# Altium schematic sheet Principal.SchDoc
size A3; SheetNumber: 2; SheetTotal: 22
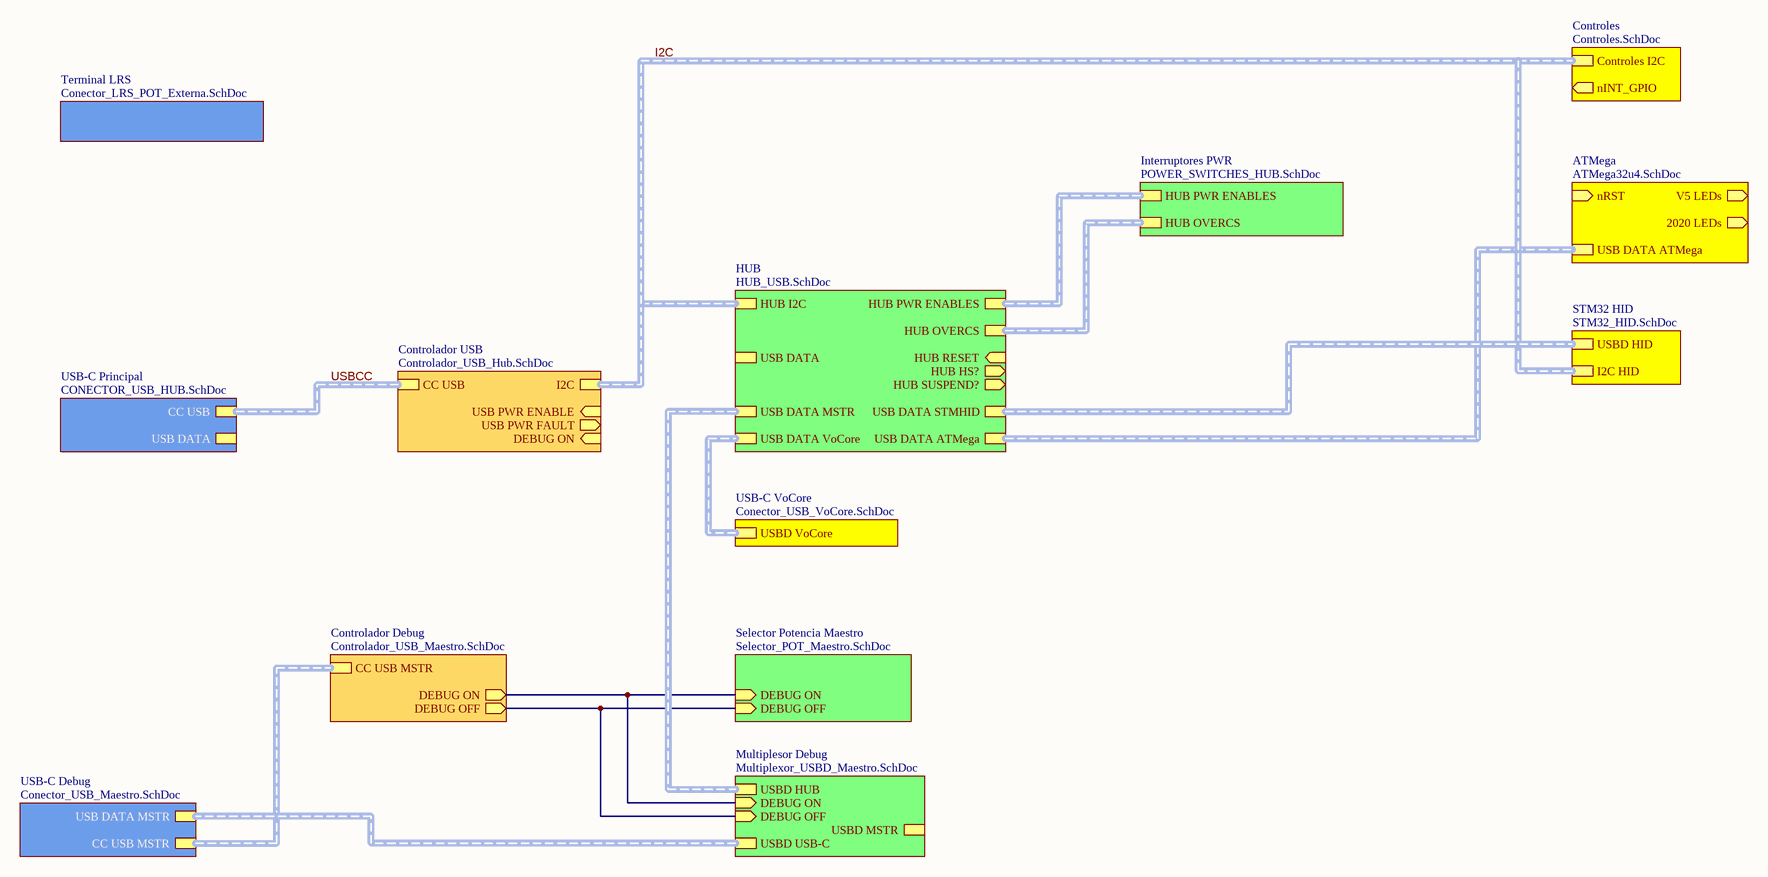
[diagram p0: Principal.SchDoc]

## Sub-sheets
ATMega = ATMega32u4.SchDoc: nRST (in), V5 LEDs (out), 2020 LEDs (out), USB DATA ATMega (harness USBD BUS)
Controlador Debug = Controlador_USB_Maestro.SchDoc: DEBUG ON (out), DEBUG OFF (out), CC USB MSTR (harness CC LINK)
Controlador USB = Controlador_USB_Hub.SchDoc: I2C (harness I2C BUS), USB PWR ENABLE (in), USB PWR FAULT (out), DEBUG ON (in), CC USB (harness CC LINK)
Controles = Controles.SchDoc: nINT_GPIO (out), Controles I2C (harness I2C BUS)
HUB = HUB_USB.SchDoc: HUB I2C (harness I2C BUS), HUB RESET (in), HUB HS? (out), HUB SUSPEND? (out), HUB PWR ENABLES (harness HUB PWR ENABLES), HUB OVERCS (harness HUB OVERC), USB DATA (harness USBD BUS), USB DATA MSTR (harness USBD BUS), USB DATA VoCore (harness USBD BUS), USB DATA ATMega (harness USBD BUS), USB DATA STMHID (harness USBD BUS)
Interruptores PWR = POWER_SWITCHES_HUB.SchDoc: HUB PWR ENABLES (harness HUB PWR ENABLES), HUB OVERCS (harness HUB OVERC)
Multiplesor Debug = Multiplexor_USBD_Maestro.SchDoc: USBD HUB (harness USBD), USBD USB-C (harness USBD), USBD MSTR (harness USBD), DEBUG ON (in), DEBUG OFF (in)
Selector Potencia Maestro = Selector_POT_Maestro.SchDoc: DEBUG ON (in), DEBUG OFF (in)
STM32 HID = STM32_HID.SchDoc: USBD HID (harness USBD BUS), I2C HID (harness I2C BUS)
Terminal LRS = Conector_LRS_POT_Externa.SchDoc: no entries
USB-C Debug = Conector_USB_Maestro.SchDoc: USB DATA MSTR (harness USBD LINK), CC USB MSTR (harness CC LINK)
USB-C Principal = CONECTOR_USB_HUB.SchDoc: USB DATA (harness USBD LINK), CC USB (harness CC LINK)
USB-C VoCore = Conector_USB_VoCore.SchDoc: USBD VoCore (harness USBD BUS)

## Nets
(unnamed): sheet Controlador Debug/DEBUG ON, sheet Multiplesor Debug/DEBUG ON, sheet Selector Potencia Maestro/DEBUG ON
(unnamed): sheet Controlador Debug/DEBUG OFF, sheet Multiplesor Debug/DEBUG OFF, sheet Selector Potencia Maestro/DEBUG OFF

## Buses and harness runs
harness I2C = sheet Controlador USB/I2C = sheet Controles/Controles I2C = sheet HUB/HUB I2C = sheet STM32 HID/I2C HID
harness sheet ATMega/USB DATA ATMega = sheet HUB/USB DATA ATMega
harness sheet Controlador Debug/CC USB MSTR = sheet USB-C Debug/CC USB MSTR
harness sheet HUB/HUB OVERCS = sheet Interruptores PWR/HUB OVERCS
harness sheet HUB/HUB PWR ENABLES = sheet Interruptores PWR/HUB PWR ENABLES
harness sheet HUB/USB DATA MSTR = sheet Multiplesor Debug/USBD HUB
harness sheet HUB/USB DATA STMHID = sheet STM32 HID/USBD HID
harness sheet HUB/USB DATA VoCore = sheet USB-C VoCore/USBD VoCore
harness sheet Multiplesor Debug/USBD USB-C = sheet USB-C Debug/USB DATA MSTR
harness USBCC = sheet Controlador USB/CC USB = sheet USB-C Principal/CC USB